# EAGLE design untitled (EAGLE 8.6.0)
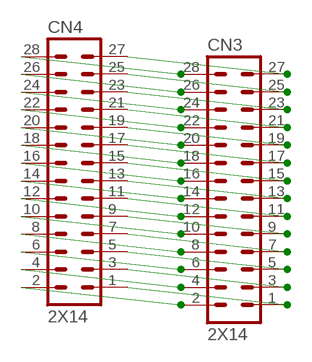
[diagram p0: schematic, sheet 1]

## Parts
CN3  2X14  [2MM_14X2]
CN4  2X14  [2MM_14X2]

## Nets
N$2: CN3.1 CN4.1
N$3: CN3.3 CN4.3
N$4: CN3.5 CN4.5
N$5: CN3.2 CN4.2
N$6: CN3.4 CN4.4
N$7: CN3.6 CN4.6
N$8: CN3.7 CN4.7
N$9: CN3.9 CN4.9
N$10: CN3.8 CN4.8
N$11: CN3.10 CN4.10
N$12: CN3.11 CN4.11
N$13: CN3.13 CN4.13
N$14: CN3.15 CN4.15
N$15: CN3.12 CN4.12
N$16: CN3.14 CN4.14
N$17: CN3.16 CN4.16
N$18: CN3.17 CN4.17
N$19: CN3.19 CN4.19
N$20: CN3.18 CN4.18
N$21: CN3.20 CN4.20
N$22: CN3.21 CN4.21
N$23: CN3.23 CN4.23
N$24: CN3.25 CN4.25
N$25: CN3.22 CN4.22
N$26: CN3.24 CN4.24
N$27: CN3.26 CN4.26
N$28: CN3.27 CN4.27
N$29: CN3.28 CN4.28

## Library data of the parts
CN3 = 4 _l__l_:2X14
CN4 = 4 _ll_ll_:2X14

## Board
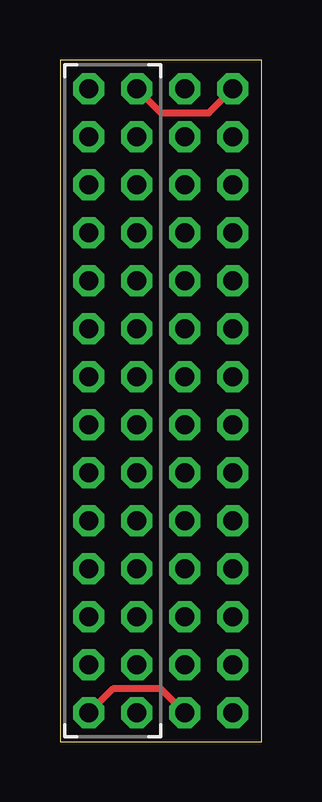
[diagram p1: board, top side]
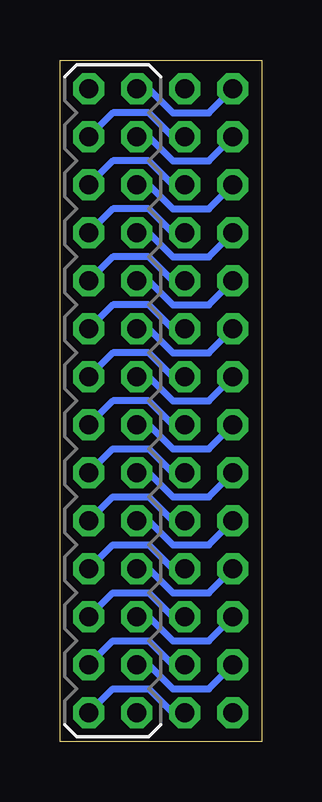
[diagram p2: board, bottom side, seen from below]

Size 8.4 x 28.4 mm. Coordinates in mm from the lower left corner, seen from the top.
Outline: 8.4,28.4 0,28.4 0,0 8.4,0 8.4,28.4
Copper layers (1*16): Top 0.035mm / dielectric 1.5mm / Bottom 0.035mm
Design rules "SeeedStudio_2layer_DRU_no_angle_20140221_IMD555": minimum track width 0.2mm, minimum drill 0.3mm, track to track 0.2mm, track to pad 0.2mm, pad to pad 0.2mm, via to via 0.2mm, smd to smd 0mil, copper to edge 0.2mm, drill to drill 10mil, minimum pad ring 0.25mm, minimum via ring 0.2mm, stop-mask expansion 0.03mm, vias tented up to drill 5mm, thermal gap 10mil

### Footprints (pad centres in the part's own frame; a part is rotated, then mirrored left to right if it is on the bottom)
2MM_14X2 = drill 0.8 pad 1.3 octagon: 1 -13,-1; 2 -13,1; 3 -11,-1; 4 -11,1; 5 -9,-1; 6 -9,1; 7 -7,-1; 8 -7,1; 9 -5,-1; 10 -5,1; 11 -3,-1; 12 -3,1; 13 -1,-1; 14 -1,1; 15 1,-1; 16 1,1; 17 3,-1; 18 3,1; 19 5,-1; 20 5,1; 21 7,-1; 22 7,1; 23 9,-1; 24 9,1; 25 11,-1; 26 11,1; 27 13,-1; 28 13,1
2MM_14X2' = drill 0.8 pad 1.3 octagon: 1 13,-1; 2 13,1; 3 11,-1; 4 11,1; 5 9,-1; 6 9,1; 7 7,-1; 8 7,1; 9 5,-1; 10 5,1; 11 3,-1; 12 3,1; 13 1,-1; 14 1,1; 15 -1,-1; 16 -1,1; 17 -3,-1; 18 -3,1; 19 -5,-1; 20 -5,1; 21 -7,-1; 22 -7,1; 23 -9,-1; 24 -9,1; 25 -11,-1; 26 -11,1; 27 -13,-1; 28 -13,1

### Placement (x,y rotation side)
CN3  6.2,14.2 90 bottom
CN4  2X14  [2MM_14X2']  2.2,14.2 270 top

### Tracks (layer width: path | path; a pad name or v marks a point on that pad's centre or on a via)
N$2
  Top 0.3: CN3.1 4.2,2.2 2.2,2.2 CN4.1
N$3
  Bottom 0.3: CN3.3 4.7,3.2 3.7,2.2 2.2,2.2 CN4.3
N$4
  Bottom 0.3: CN3.5 4.7,5.2 3.7,4.2 2.2,4.2 CN4.5
N$5
  Bottom 0.3: CN3.2 6.2,2.2 4.7,2.2 3.7,1.2 CN4.2
N$6
  Bottom 0.3: CN3.4 6.2,4.2 4.7,4.2 3.7,3.2 CN4.4
N$7
  Bottom 0.3: CN3.6 6.2,6.2 4.7,6.2 3.7,5.2 CN4.6
N$8
  Bottom 0.3: CN3.7 4.7,7.2 3.7,6.2 2.2,6.2 CN4.7
N$9
  Bottom 0.3: CN3.9 4.7,9.2 3.7,8.2 2.2,8.2 CN4.9
N$10
  Bottom 0.3: CN3.8 6.2,8.2 4.7,8.2 3.7,7.2 CN4.8
N$11
  Bottom 0.3: CN3.10 6.2,10.2 4.7,10.2 3.7,9.2 CN4.10
N$12
  Bottom 0.3: CN3.11 4.7,11.2 3.7,10.2 2.2,10.2 CN4.11
N$13
  Bottom 0.3: CN3.13 4.7,13.2 3.7,12.2 2.2,12.2 CN4.13
N$14
  Bottom 0.3: CN3.15 4.7,15.2 3.7,14.2 2.2,14.2 CN4.15
N$15
  Bottom 0.3: CN3.12 6.2,12.2 4.7,12.2 3.7,11.2 CN4.12
N$16
  Bottom 0.3: CN3.14 6.2,14.2 4.7,14.2 3.7,13.2 CN4.14
N$17
  Bottom 0.3: CN4.16 3.7,15.2 4.7,16.2 6.2,16.2 CN3.16
N$18
  Bottom 0.3: CN3.17 4.7,17.2 3.7,16.2 2.2,16.2 CN4.17
N$19
  Bottom 0.3: CN3.19 4.7,19.2 3.7,18.2 2.2,18.2 CN4.19
N$20
  Bottom 0.3: CN4.18 3.7,17.2 4.7,18.2 6.2,18.2 CN3.18
N$21
  Bottom 0.3: CN4.20 3.7,19.2 4.7,20.2 6.2,20.2 CN3.20
N$22
  Bottom 0.3: CN3.21 4.7,21.2 3.7,20.2 2.2,20.2 CN4.21
N$23
  Bottom 0.3: CN3.23 4.7,23.2 3.7,22.2 2.2,22.2 CN4.23
N$24
  Bottom 0.3: CN3.25 4.7,25.2 3.7,24.2 2.2,24.2 CN4.25
N$25
  Bottom 0.3: CN4.22 3.7,21.2 4.7,22.2 6.2,22.2 CN3.22
N$26
  Bottom 0.3: CN4.24 3.7,23.2 4.7,24.2 6.2,24.2 CN3.24
N$27
  Bottom 0.3: CN4.26 3.7,25.2 4.7,26.2 6.2,26.2 CN3.26
N$28
  Bottom 0.3: CN3.27 4.7,27.2 3.7,26.2 2.2,26.2 CN4.27
N$29
  Top 0.3: CN4.28 4.2,26.2 6.2,26.2 CN3.28